# EAGLE design lilyfab (EAGLE 7.2.0)
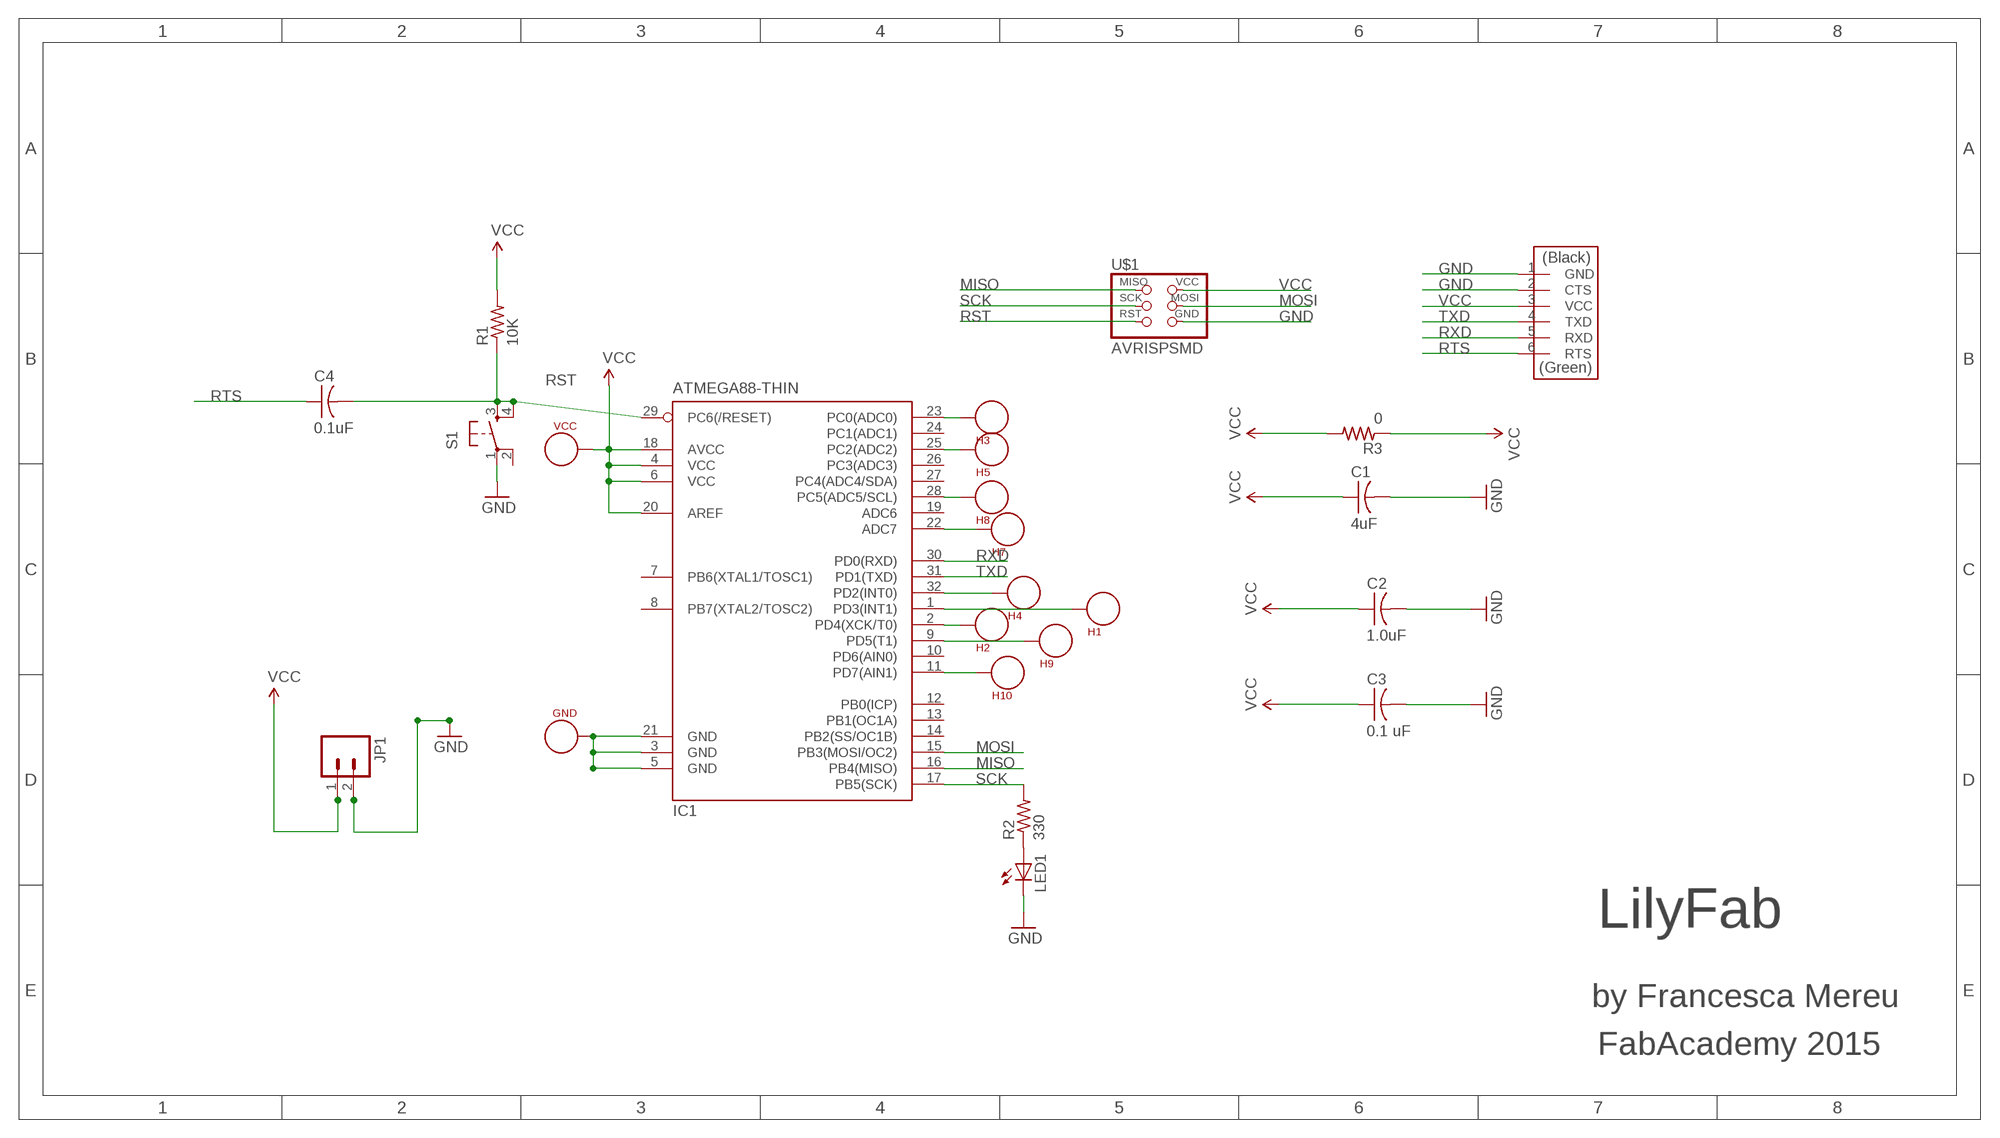
[diagram p0: schematic, sheet 1]

## Parts
C1  4uF  CAP-US1206FAB  [C1206FAB]
C2  1.0uF  CAP-US1206  [C1206]
C3  0.1 uF  CAP-US1206  [C1206]
C4  0.1uF  CAP-US1206  [C1206]
GND  SEW_HOLE  [SIMPLE_HOLE]
H1  SEW_HOLE  [SIMPLE_HOLE]
H2  SEW_HOLE  [SIMPLE_HOLE]
H3  SEW_HOLE  [SIMPLE_HOLE]
H4  SEW_HOLE  [SIMPLE_HOLE]
H5  SEW_HOLE  [SIMPLE_HOLE]
H7  SEW_HOLE  [SIMPLE_HOLE]
H8  SEW_HOLE  [SIMPLE_HOLE]
H9  SEW_HOLE  [SIMPLE_HOLE]
H10  SEW_HOLE  [SIMPLE_HOLE]
IC1  ATMEGA88-THIN  [TQFP32-08THIN]
JP1  M02PTH  [1X02]
LED1  LED1206  [LED-1206]
R1  10K  RES-US1206W  [R1206W]
R2  330  RES-US1206FAB  [R1206FAB]
R3  0  RES-US1206FAB  [R1206FAB]
S1  6MM_SWITCH6MM_SWITCH  [6MM_SWITCH]
U$1  AVRISPSMD  [2X03SMD]
U$3  FTDI-SMD-HEADER  [1X06SMD]
VCC  SEW_HOLE  [SIMPLE_HOLE]

## Nets
GND: C1.2 C2.2 C3.2 JP1.2 LED1.C S1.1(P) U$1.6(GND) U$3.1(GND) U$3.2(CTS)
MISO: IC1.16(PB4(MISO)) U$1.1(MISO)
MOSI: IC1.15(PB3(MOSI/OC2)) U$1.4(MOSI)
N$3: H3.P$1 IC1.23(PC0(ADC0))
N$4: H7.P$1 IC1.22(ADC7)
N$5: LED1.A R2.1
N$6: H5.P$1 IC1.25(PC2(ADC2))
N$8: H8.P$1 IC1.28(PC5(ADC5/SCL))
N$9: H4.P$1 IC1.32(PD2(INT0))
N$10: H1.P$1 IC1.1(PD3(INT1))
N$11: H2.P$1 IC1.2(PD4(XCK/T0))
N$12: H9.P$1 IC1.9(PD5(T1))
N$13: H10.P$1 IC1.11(PD7(AIN1))
N$16: GND.P$1 IC1.3(GND) IC1.5(GND) IC1.21(GND)
RST: C4.2 IC1.29(PC6(/RESET)) R1.1 S1.3(S) S1.4(S1) U$1.5(RST)
RTS: C4.1 U$3.6(RTS)
RXD: U$3.5(RXD)
SCK: IC1.17(PB5(SCK)) R2.2 U$1.3(SCK)
TXD: U$3.4(TXD)
VCC: C1.1 C2.1 C3.1 IC1.4(VCC) IC1.6(VCC) IC1.18(AVCC) IC1.20(AREF) JP1.1 R1.2 R3.1 R3.2 U$1.2(VCC) U$3.3(VCC) VCC.P$1
Unconnected: IC1.7(PB6(XTAL1/TOSC1)) IC1.8(PB7(XTAL2/TOSC2)) IC1.10(PD6(AIN0)) IC1.12(PB0(ICP)) IC1.13(PB1(OC1A)) IC1.14(PB2(SS/OC1B)) IC1.19(ADC6) IC1.24(PC1(ADC1)) IC1.26(PC3(ADC3)) IC1.27(PC4(ADC4/SDA)) IC1.30(PD0(RXD)) IC1.31(PD1(TXD)) S1.2(P1)

## Notes on the sheet
- LilyFab
- by Francesca Mereu
- FabAcademy 2015

## Library data of the parts
C1-C4 = fab:CAP-US
GND H1-H5 H7-H10 VCC = LilyPad-Wearables:SEW_HOLE: Simple sew-hole .1" diameter hole with 20mil annular ring
IC1 = fab:ATMEGA88-THIN
JP1 = SparkFun-Connectors:M02: Standard 2-pin 0.1" header. Use with - straight break away headers ( PRT-00116) - right angle break away headers (PRT-00553) - swiss pins (PRT-00743) - machine pins (PRT-00117) - female headers (PRT-00115) Molex polarized connector foot print use with: PRT-08233 with associated crimp pins and housings. 2.54_SCREWTERM for use with PRT-10571. 3.5mm Screw Terminal footprints for PRT-08084 5mm Screw Terminal footprints for use with PRT-08432
LED1 = LilyPad-Wearables:LED: LEDs Standard schematic elements and footprints for 5mm, 3mm, 1206, and 0603 sized LEDs. 5mm - Spark Fun Electronics SKU : Comp-SBL
R1-R3 = fab:RES-US: Resistor (US Symbol) Variants with postfix FAB are widened to allow the routing of internal traces
S1 = fab:6MM_SWITCH: OMRON SWITCH
U$1 = fab:AVRISP
U$3 = fab:FTDI-SMD-HEADER

## Board
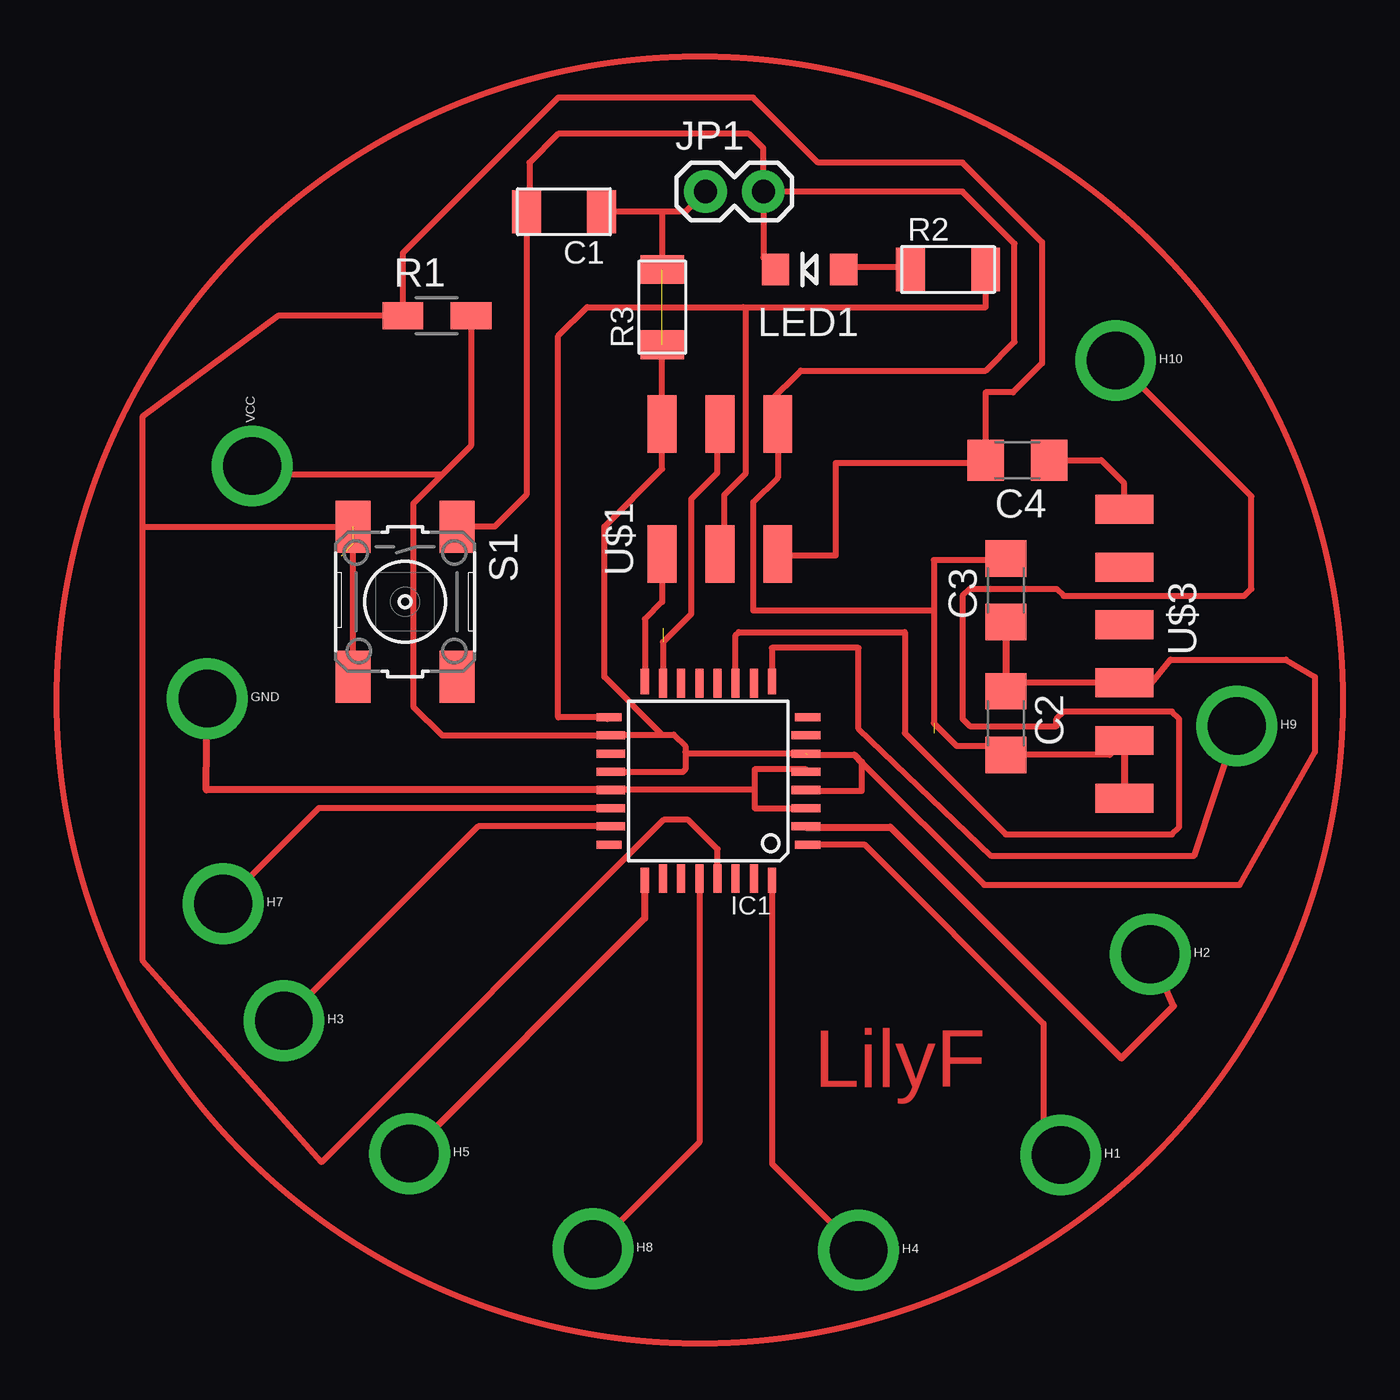
[diagram p1: board, top side]

No outline drawn. Coordinates in mm, seen from the top.
Copper layers (1*16): Top 0.035mm / dielectric 1.5mm / Bottom 0.035mm
Design rules "default": minimum track width 10mil, minimum drill 24mil, track to track 8mil, track to pad 8mil, pad to pad 8mil, via to via 8mil, smd to smd 8mil, copper to edge 40mil, drill to drill 8mil, minimum pad ring 10mil, minimum via ring 8mil, stop-mask expansion 4mil, vias tented up to drill 0mil, thermal gap 10mil

### Footprints (pad centres in the part's own frame; a part is rotated, then mirrored left to right if it is on the bottom)
C1206FAB = smd 1.27 x 1.905: 1 -1.651,0; 2 1.651,0
C1206 = smd 1.6 x 1.8: 1 -1.4,0; 2 1.4,0
SIMPLE_HOLE = drill 2.54 pad 3.048: P$1 0,0
TQFP32-08THIN = smd 1.118 x 0.356: 1 -4.369,2.8; 8 -4.369,-2.8; 17 4.369,-2.8; 24 4.369,2.8 | smd 1.27 x 0.356: 2 -4.293,2; 3 -4.293,1.2; 4 -4.293,0.4; 5 -4.293,-0.4; 6 -4.293,-1.2; 7 -4.293,-2; 18 4.293,-2; 19 4.293,-1.2; 20 4.293,-0.4; 21 4.293,0.4; 22 4.293,1.2; 23 4.293,2 | smd 0.356 x 1.118: 9 -2.8,-4.369; 16 2.8,-4.369; 25 2.8,4.369; 32 -2.8,4.369 | smd 0.356 x 1.27: 10 -2,-4.293; 14 1.2,-4.293; 15 2,-4.293; 26 2,4.293; 27 1.2,4.293; 31 -2,4.293 | smd 0.35 x 1.27: 11 -1.2,-4.293; 12 -0.4,-4.293; 13 0.4,-4.293; 28 0.4,4.293; 29 -0.4,4.293; 30 -1.2,4.293
1X02 = drill 1.016 pad 1.88: 1 0,0; 2 2.54,0
LED-1206 = smd 1.2 x 1.4: A -1.5,0; C 1.5,0
R1206W = smd 1.8 x 1.2: 1 -1.499,0; 2 1.499,0
R1206FAB = smd 1.27 x 1.905: 1 -1.651,0; 2 1.651,0
6MM_SWITCH = smd 2.286 x 1.524: 1 -3.302,2.286; 2 3.302,2.286; 3 -3.302,-2.286; 4 3.302,-2.286
2X03SMD = smd 2.54 x 1.27: 1 -2.857,2.54; 2 2.857,2.54; 3 -2.857,0; 4 2.857,0; 5 -2.857,-2.54; 6 2.857,-2.54
1X06SMD = smd 2.54 x 1.27: 1 0,6.35; 2 0,3.81; 3 0,1.27; 4 0,-1.27; 5 0,-3.81; 6 0,-6.35

### Placement (x,y rotation side)
C1  56.13,74.04 180 top
C2  75.56,51.56 270 top
C3  75.56,57.4 90 top
C4  76.07,63.12 180 top
GND  40.45,52.64 0 top
H1  77.98,32.58 0 top
H2  81.92,41.4 0 top
H3  43.81,38.48 0 top
H4  69.09,28.38 0 top
H5  49.34,32.64 0 top
H7  41.15,43.62 0 top
H8  57.4,28.45 0 top
H9  85.72,51.44 0 top
H10  80.39,67.5 0 top
IC1  62.48,49.02 180 top
JP1  62.36,74.93 0 top
LED1  66.93,71.5 180 top
R1  50.55,69.47 0 top
R2  73.03,71.5 0 top
R3  60.45,69.85 90 top
S1  49.15,56.9 270 top
U$1  62.99,61.85 90 top
U$3  80.77,54.61 180 top
VCC  42.42,62.87 90 top

### Tracks (layer width: path | path; a pad name or v marks a point on that pad's centre or on a via)
GND  (1 unrouted)
  Top 0.254: 72.39,56.52 72.39,58.74 75.5,58.74 C3.2 76.08,58.8 76.2,58.93 | 72.39,56.52 72.39,51.56 73.41,50.55 75.18,50.55 C2.2 | 76.2,50.8 C2.2 | 72.39,56.52 64.45,56.52 64.45,61.28 65.53,62.36 U$1.6 65.53,65.28 65.15,65.66 66.55,67.06 74.68,67.06 75.95,68.33 75.95,72.64 73.66,74.93 JP1.2 | JP1.2 64.9,72.03 LED1.C 65.3,71.37 65.28,71.37 | JP1.2 64.9,76.83 64.26,77.47 55.88,77.47 54.61,76.2 54.61,74.17 C1.2 54.48,61.59 53.09,60.2 S1.1 | U$3.2 80.13,50.16 C2.2
  Top 0.305: U$3.2 U$3.1
MISO
  Top 0.254: U$1.1 60.45,56.9 59.69,56.13 59.69,53.85 59.68,53.84 IC1.16
MOSI  (1 unrouted)
  Top 0.254: U$1.4 62.87,64.58 62.87,62.55 61.72,61.4 61.72,56.36 60.48,55.12 IC1.15
N$3
  Top 0.254: IC1.23 52.36,47.02 H3.P$1
N$4
  Top 0.254: IC1.22 45.35,47.82 H7.P$1
N$5
  Top 0.254: LED1.A 68.56,71.63 71.63,71.63 R2.1
N$6
  Top 0.305: IC1.25 59.68,42.98 H5.P$1
N$8
  Top 0.254: IC1.28 62.08,33.13 H8.P$1
N$9
  Top 0.254: IC1.32 65.28,32.19 H4.P$1
N$10
  Top 0.254: IC1.1 69.34,46.23 77.22,38.35 77.22,33.34 H1.P$1
N$11
  Top 0.305: IC1.2 66.78,46.99 70.48,46.99 80.64,36.83 82.93,39.12 H2.P$1
N$12
  Top 0.254: H9.P$1 83.82,45.72 74.93,45.72 69.09,51.31 69.09,54.86 65.28,54.86 IC1.9
N$13
  Top 0.254: IC1.11 63.68,55.43 63.82,55.56 71.12,55.56 71.12,51.12 75.56,46.67 82.87,46.67 83.19,46.99 83.19,51.75 82.87,52.07 78.11,52.07 77.79,51.75 77.79,51.44 73.98,51.44 73.66,51.75 73.66,57.15 73.98,57.47 77.79,57.47 78.11,57.15 86.04,57.15 86.36,57.47 86.36,61.53 H10.P$1
N$16
  Top 0.254: IC1.5 66.78,49.53 64.52,49.53 64.52,48.62 | 64.52,48.62 64.52,47.82 IC1.3 | 64.52,48.62 IC1.21
  Top 0.305: IC1.21 40.41,48.62 GND.P$1
RST  (2 unrouted)
  Top 0.254: S1.4 S1.3 37.59,60.2 | U$1.5 65.6,58.93 68.07,58.93 68.07,62.99 74.55,62.99 C4.2 74.67,66.11 75.88,66.11 77.15,67.38 77.15,72.71 73.66,76.2 67.31,76.2 64.45,79.06 55.88,79.06 49.05,72.22 R1.1 43.56,69.47 37.59,65.02 37.59,60.2 | IC1.29 62.88,46.02 61.59,47.31 60.52,47.31 45.47,32.26 37.59,41.15 37.59,60.2
RTS
  Top 0.254: C4.1 79.76,63.12 80.77,62.1 U$3.6
SCK
  Top 0.254: 63.25,58.99 U$1.3 63.18,59.18 63.18,61.59 64.14,62.55 64.14,69.72 64.01,69.85 | 58.05,51.75 IC1.17 55.88,51.82 55.88,68.58 57.15,69.85 64.01,69.85 | 64.01,69.85 74.68,69.85 R2.2
VCC  (2 unrouted)
  Top 0.254: 67.31,48.58 69.22,48.58 69.22,49.85 74.61,44.45 85.85,44.45 89.15,50.29 89.15,53.59 87.88,54.36 82.8,54.36 81.79,53.09 U$3.3 75.94,53.34 C2.1 | 61.47,50.29 61.47,50.55 60.96,51.05 60.45,51.05 | 61.47,50.29 61.47,49.53 61.36,49.42 IC1.20 | 60.45,51.05 58.22,51.05 IC1.18 50.77,51.02 49.51,52.29 49.51,61.21 50.79,62.5 | 60.45,51.05 57.91,53.59 57.91,60.2 60.45,62.74 U$1.2 R3.1 | 61.47,50.29 61.54,50.22 IC1.6 | 66.83,50.16 68.9,50.16 | R1.2 52.05,63.75 50.79,62.5 | VCC.P$1 42.79,62.5 50.79,62.5 | JP1.1 61.47,74.04 60.45,74.04 | 60.45,74.04 C1.1 | 60.45,74.04 R3.2
  Top 0.305: 68.9,50.16 69.22,49.85 | 67.31,48.58 67.27,48.62 IC1.4 | C3.1 C2.1
(copper drawn outside any net)
  shapes: Top circle x1

### Text on the board
Top: LilyF